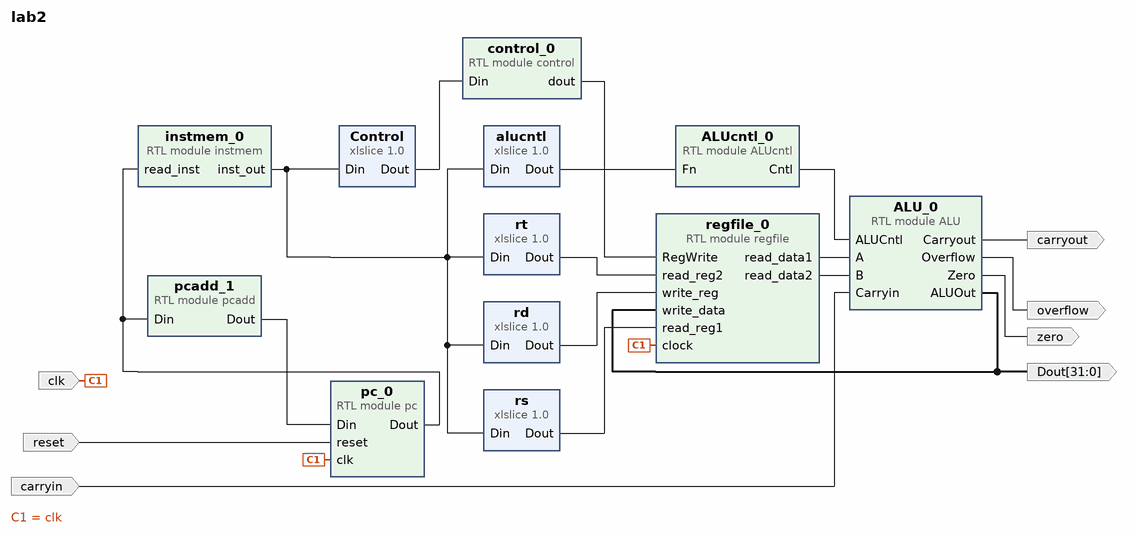
[diagram p0: block diagram of the top level]
# Vivado block design lab2, xc7a15tcpg236-1, Vivado 2018.1
create_bd_design lab2

create_bd_port -dir O -from 31 -to 0 Dout
create_bd_port -dir I clk
create_bd_port -dir I reset
create_bd_port -dir I carryin
create_bd_port -dir O carryout
create_bd_port -dir O overflow
create_bd_port -dir O zero

create_bd_cell -type module -reference pcadd pcadd_1
create_bd_cell -type module -reference instmem instmem_0
create_bd_cell -type module -reference control control_0
create_bd_cell -type module -reference regfile regfile_0
create_bd_cell -type ip -vlnv xilinx.com:ip:xlslice:1.0 Control
set_property -dict {CONFIG.DIN_TO 26 CONFIG.DIN_FROM 31 CONFIG.DOUT_WIDTH 6} [get_bd_cells Control]
create_bd_cell -type ip -vlnv xilinx.com:ip:xlslice:1.0 rs
set_property -dict {CONFIG.DIN_TO 21 CONFIG.DIN_FROM 25 CONFIG.DOUT_WIDTH 5} [get_bd_cells rs]
create_bd_cell -type ip -vlnv xilinx.com:ip:xlslice:1.0 rt
set_property -dict {CONFIG.DIN_TO 16 CONFIG.DIN_FROM 20 CONFIG.DOUT_WIDTH 5} [get_bd_cells rt]
create_bd_cell -type ip -vlnv xilinx.com:ip:xlslice:1.0 rd
set_property -dict {CONFIG.DIN_TO 11 CONFIG.DIN_FROM 15 CONFIG.DOUT_WIDTH 5} [get_bd_cells rd]
create_bd_cell -type ip -vlnv xilinx.com:ip:xlslice:1.0 alucntl
set_property -dict {CONFIG.DIN_FROM 5 CONFIG.DOUT_WIDTH 6} [get_bd_cells alucntl]
create_bd_cell -type module -reference pc pc_0
create_bd_cell -type module -reference ALU ALU_0
create_bd_cell -type module -reference ALUcntl ALUcntl_0

# ---- connections ----

connect_bd_net [get_bd_pins pcadd_1/Dout] [get_bd_pins pc_0/Din]
connect_bd_net [get_bd_pins pc_0/Dout] [get_bd_pins pcadd_1/Din] [get_bd_pins instmem_0/read_inst]
connect_bd_net [get_bd_pins instmem_0/inst_out] \
  [get_bd_pins Control/Din] [get_bd_pins rs/Din] [get_bd_pins rt/Din] [get_bd_pins rd/Din] [get_bd_pins alucntl/Din]
connect_bd_net [get_bd_pins Control/Dout] [get_bd_pins control_0/Din]
connect_bd_net [get_bd_pins control_0/dout] [get_bd_pins regfile_0/RegWrite]
connect_bd_net [get_bd_pins rd/Dout] [get_bd_pins regfile_0/write_reg]
connect_bd_net [get_bd_pins rt/Dout] [get_bd_pins regfile_0/read_reg2]
connect_bd_net [get_bd_pins rs/Dout] [get_bd_pins regfile_0/read_reg1]
connect_bd_net [get_bd_pins alucntl/Dout] [get_bd_pins ALUcntl_0/Fn]
connect_bd_net [get_bd_pins ALUcntl_0/Cntl] [get_bd_pins ALU_0/ALUCntl]
connect_bd_net [get_bd_pins regfile_0/read_data1] [get_bd_pins ALU_0/A]
connect_bd_net [get_bd_pins regfile_0/read_data2] [get_bd_pins ALU_0/B]
connect_bd_net [get_bd_pins ALU_0/ALUOut] [get_bd_ports Dout] [get_bd_pins regfile_0/write_data]
connect_bd_net [get_bd_ports clk] [get_bd_pins regfile_0/clock] [get_bd_pins pc_0/clk]
connect_bd_net [get_bd_ports reset] [get_bd_pins pc_0/reset]
connect_bd_net [get_bd_ports carryin] [get_bd_pins ALU_0/Carryin]
connect_bd_net [get_bd_pins ALU_0/Carryout] [get_bd_ports carryout]
connect_bd_net [get_bd_pins ALU_0/Overflow] [get_bd_ports overflow]
connect_bd_net [get_bd_pins ALU_0/Zero] [get_bd_ports zero]

validate_bd_design
save_bd_design
